# EAGLE schematic arduino_shield (EAGLE 5.11)
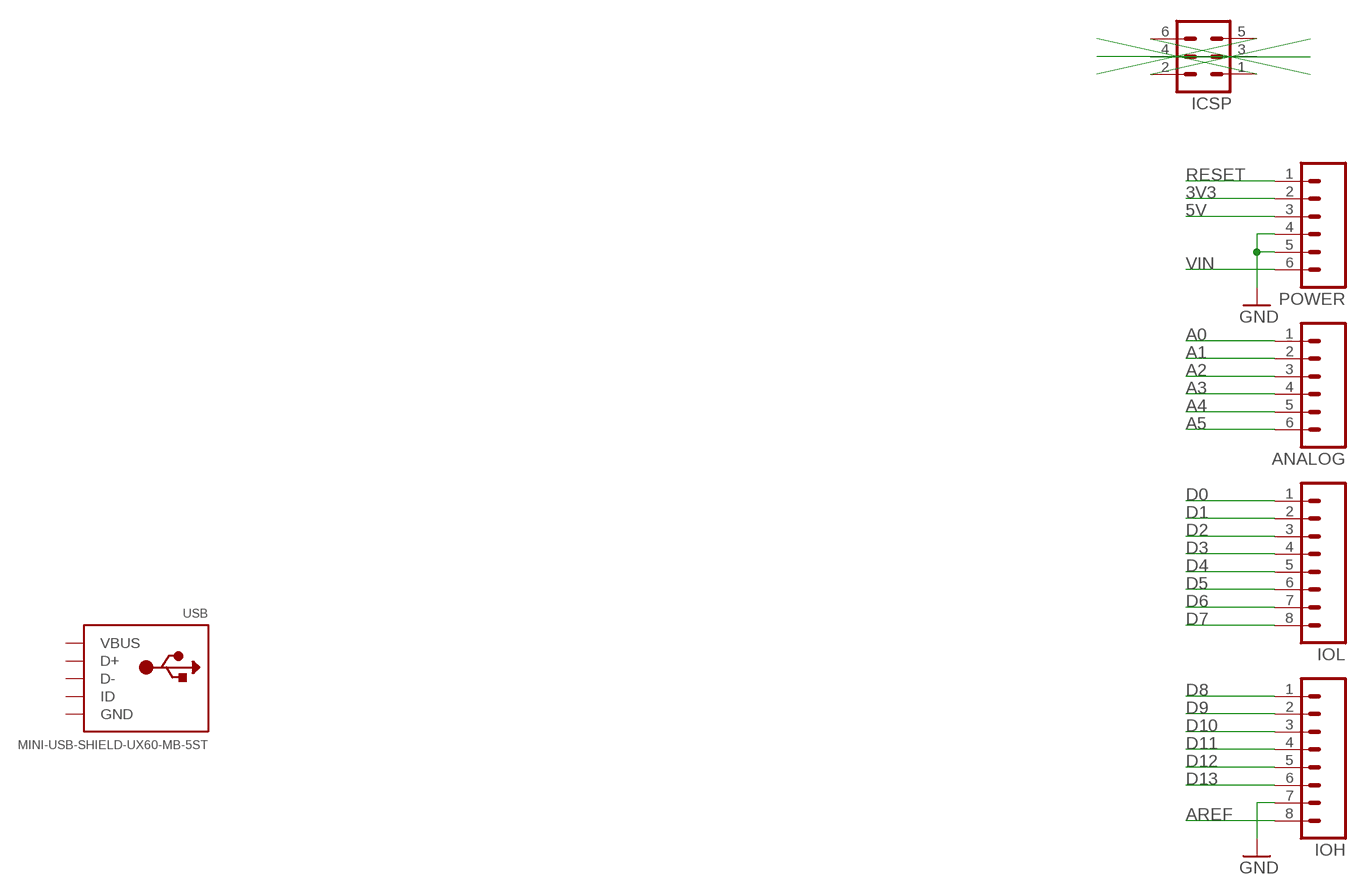
[diagram p0: schematic, sheet 1]

## Parts
ANALOG  M06SIP  [1X06]
ICSP  M03X2  [2X03]
IOH  M081X08  [1X08]
IOL  M081X08  [1X08]
POWER  M06SIP  [1X06]
USB  MINI-USB-SHIELD-UX60-MB-5ST  USBMINIB  [USB-MINIB]

## Nets
3V3: POWER.2
5V: POWER.3
A0: ANALOG.1
A1: ANALOG.2
A2: ANALOG.3
A3: ANALOG.4
A4: ANALOG.5
A5: ANALOG.6
AREF: IOH.8
D0: IOL.1
D1: IOL.2
D2: IOL.3
D3: IOL.4
D4: IOL.5
D5: IOL.6
D6: IOL.7
D7: IOL.8
D8: IOH.1
D9: IOH.2
D10: IOH.3
D11: IOH.4
D12: IOH.5
D13: IOH.6
GND: IOH.7 POWER.4 POWER.5
N$17: ICSP.1
N$18: ICSP.3
N$19: ICSP.5
N$20: ICSP.6
N$21: ICSP.4
N$22: ICSP.2
RESET: POWER.1
VIN: POWER.6
Unconnected: USB.D+ USB.D- USB.ID

## Power pins joined to a net without a drawn wire
GND: USB.GND
VBUS: USB.VBUS

## Library data of the parts
ANALOG POWER = SparkFun:M06: Header 6 Standard 6-pin 0.1" header. Use with straight break away headers (SKU : PRT-00116), right angle break away headers (PRT-00553), swiss pins (PRT-00743), machine pins (PRT-00117), and female headers (PRT-00115). Molex polarized connector foot print use with SKU : PRT-08094 with associated crimp pins and housings. NOTES ON THE VARIANTS LOCK and LOCK_LONGPADS... This footprint was designed to help hold the alignment of a through-hole component (i.e. 6-pin header) while soldering it into place. You may notice that each hole has been shifted either up or down by 0.005 of an inch from it's more standard position (which is a perfectly straight line). This slight alteration caused the pins (the squares in the middle) to touch the edges of the holes. Because they are alternating, it causes a "brace" to hold the component in place. 0.005 has proven to be the perfect amount of "off-center" position when using our standard breakaway headers. Although looks a little odd when you look at the bare footprint, once you have a header in there, the alteration is very hard to notice. Also, if you push a header all the way into place, it is covered up entirely on the bottom side. This idea of altering the position of holes to aid alignment will be further integrated into the Sparkfun Library for other footprints. It can help hold any component with 3 or more connection pins.
ICSP = adilinden:M03X2: This is a 3x2 pin header Note: This part is based on the Sparkfun M04X2 header.
IOH IOL = SparkFun:M08: Header 8 Standard 8-pin 0.1" header. Use with straight break away headers (SKU : PRT-00116), right angle break away headers (PRT-00553), swiss pins (PRT-00743), machine pins (PRT-00117), and female headers (PRT-00115).
USB = adafruit:USB: USB Connectors USBMINIB - Surface Mount Female Mini-B USB Connector 4UConnector: 06564 By microbuilder.eu Thru-hole RA Female Mini-B USB Connector 4UConnector: 18732 By ladyada.net